# Altium schematic sheet [3] - PIC18F SUBSYSTEM SCHEMATIC.SchDoc (part 2 of 3)
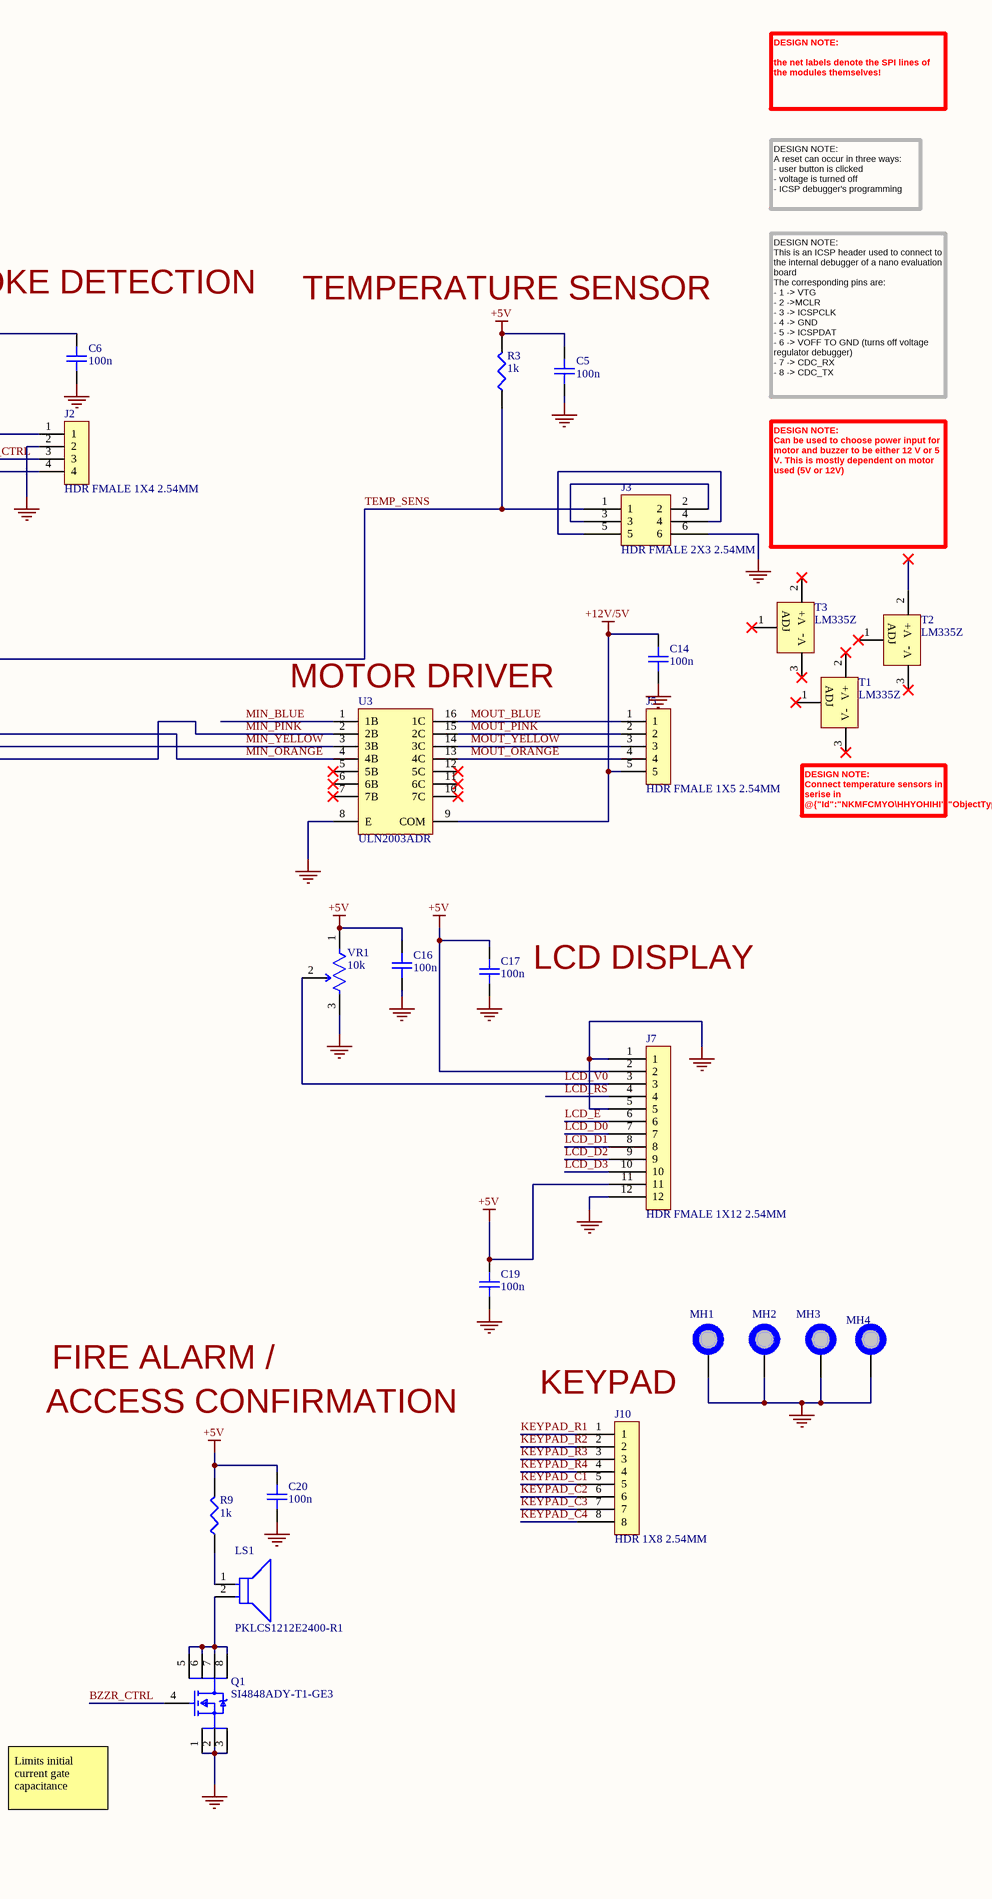
[diagram p2: [3] - PIC18F SUBSYSTEM SCHEMATIC.SchDoc, right]
## Library data of the parts
? = SDTitleBlock
C1 C2 C5-C7 C9 C10 C13-C24 = C2012X7R1H104K085AA: Ceramic Capacitor, Multilayer, Ceramic, 50V, 10% +Tol, 10% -Tol, X7R, 15% TC, 0.1uF, Surface Mount, 0805; Manufacturer: TDK; Value: 100nF; Multilayer: Yes; Supplier: Digikey; Supplier Part Number: 445-7534-1-ND; Manufacturer Part Number: C2012X7R1H104K085AA; RoHS: Yes; Category: Ceramic Capacitors; Stock: 1413569; Pricing: 1=0.13, 10=0.071, 50=0.0494, 100=0.0426, 500=0.03118, 1000=0.02762 (USD); Mounting Technology: Surface Mount; Pins: 2; Dielectric Material: Ceramic; Package Shape: Rectangular; Case/Package: 0805; Terminal Finish: Nickel; Min Operating Temperature: -55°C; Max Operating Temperature: 125°C; JESD-609 Code: e3; Capacitor Type: Ceramic; Tolerance  (fill in as +-): 10%; Package Style: SMTMeter; Packaging: Tape and Reel; Tolerance (fill in as +-): 10%; Rated DC Voltage (URdc): 50V; Temperature Characteristics Code: X7R; Termination: Wraparound; Length: 2mm; Width: 1.25mm; Height: 0.85mm; Reach SVHC Compliant: Yes; RoHS Compliant: Yes; ComponentLink1URL: https://datasheet.ciiva.com:443/pdfs/VipMasterIC/IC/TDKC/TDKC-S-A0008796792/TDKC-S-A0008796792-1.pdf?src-supplier=IHS+Markit; ComponentLink1Description: https://datasheet.ciiva.com:443/pdfs/VipMasterIC/IC/TDKC/TDKC-S-A0008796792/TDKC-S-A0008796792-1.pdf?src-supplier=IHS+Markit; ComponentLink2URL: https://datasheet.ciiva.com/11788/0900766b80c1bb00-11788128.pdf?src-supplier=Rs; ComponentLink2Description: https://datasheet.ciiva.com/11788/0900766b80c1bb00-11788128.pdf?src-supplier=Rs; ComponentLink3URL: https://datasheet.ciiva.com/23803/1796654-23803035.pdf?src-supplier=Newark; ComponentLink3Description: https://datasheet.ciiva.com/23803/1796654-23803035.pdf?src-supplier=Newark; ComponentLink4URL: https://datasheet.ciiva.com/28602/1571323-28602204.pdf?src-supplier=Element14; ComponentLink4Description: https://datasheet.ciiva.com/28602/1571323-28602204.pdf?src-supplier=Element14; ComponentLink5URL: https://datasheet.ciiva.com/6250/tdkmlcccaprange-6250824.pdf?src-supplier=Digikey; ComponentLink5Description: https://datasheet.ciiva.com/6250/tdkmlcccaprange-6250824.pdf?src-supplier=Digikey; ComponentLink6URL: https://datasheet.ciiva.com/24191/e412-c-24191447.pdf?src-supplier=Future+Electronics; ComponentLink6Description: https://datasheet.ciiva.com/24191/e412-c-24191447.pdf?src-supplier=Future+Electronics; ComponentLink7URL: https://datasheet.ciiva.com/6250/tdkmlcccaprange-6250821.pdf?src-supplier=Digikey; ComponentLink7Description: https://datasheet.ciiva.com/6250/tdkmlcccaprange-6250821.pdf?src-supplier=Digikey; Supplier 1: Digikey; Supplier Part Number 1: 445-7534-1-ND
C3 C4 C8 C11 C12 = C2012X5R1V106M125AC: Ceramic Capacitor, Multilayer, Ceramic, 35V, 20% +Tol, 20% -Tol, X5R, 15% TC, 10uF, Surface Mount, 0805; Manufacturer: TDK; Multilayer: Yes; Supplier: Digikey; Supplier Part Number: 445-14420-1-ND; Manufacturer Part Number: C2012X5R1V106M125AC; RoHS: Yes; Category: Ceramic Capacitors; Stock: 20704; Pricing: 1=0.71, 10=0.427, 50=0.3158, 100=0.2811, 500=0.22198, 1000=0.20353 (USD); Mounting Technology: Surface Mount; Pins: 2; Dielectric Material: Ceramic; Package Shape: Rectangular; Case/Package: 0805; Terminal Finish: Nickel; Min Operating Temperature: -55°C; Max Operating Temperature: 85°C; JESD-609 Code: e3; Value: 10uF; Capacitor Type: Ceramic; Tolerance  (fill in as +-): 20%; Package Style: SMTMeter; Packaging: Tape and Reel; Tolerance (fill in as +-): 20%; Rated DC Voltage (URdc): 35V; Temperature Characteristics Code: X5R; Termination: Wraparound; Length: 2mm; Width: 1.25mm; Height: 1.25mm; Reach SVHC Compliant: Yes; RoHS Compliant: Yes; ComponentLink1URL: https://datasheet.ciiva.com:443/pdfs/VipMasterIC/IC/TDKC/TDKC-S-A0008796792/TDKC-S-A0008796792-1.pdf?src-supplier=IHS+Markit; ComponentLink1Description: https://datasheet.ciiva.com:443/pdfs/VipMasterIC/IC/TDKC/TDKC-S-A0008796792/TDKC-S-A0008796792-1.pdf?src-supplier=IHS+Markit; ComponentLink2URL: https://datasheet.ciiva.com/14887/tdkmlcccaprange-14887484.pdf?src-supplier=Digikey; ComponentLink2Description: https://datasheet.ciiva.com/14887/tdkmlcccaprange-14887484.pdf?src-supplier=Digikey; ComponentLink3URL: https://datasheet.ciiva.com/14887/tdkmlcccaprange-14887483.pdf?src-supplier=Digikey; ComponentLink3Description: https://datasheet.ciiva.com/14887/tdkmlcccaprange-14887483.pdf?src-supplier=Digikey; ComponentLink4URL: https://datasheet.ciiva.com/14887/tdkmlcccaprange-14887485.pdf?src-supplier=Digikey; ComponentLink4Description: https://datasheet.ciiva.com/14887/tdkmlcccaprange-14887485.pdf?src-supplier=Digikey
  C3 C4: Supplier 1: Digikey; Supplier Part Number 1: 445-14420-1-ND
  C8 C11 C12: Supplier 1: Mouser; Supplier Part Number 1: 810-C2012X5R1V106M1C
D1 = VLHW5100: Single Color LED, White, Untinted Nondiffused, T-1 3/4, 5mm; Manufacturer: Vishay Semiconductors; Shape: Round; Lens Style: Untinted,NONDIFFUSED; Forward Current: 30mA; Forward Voltage: 3.6V; Luminous Intensity-Nom: 8400mcd; Channels: 1; Reverse Voltage-Max: 5V; T-code: T-1 3/4; Viewing Angle: 20°; Overall Height: 8.6mm; Supplier: Mouser; Supplier Part Number: 78-VLHW5100; Manufacturer Part Number: VLHW5100; RoHS: Yes; Category: LEDs; Stock: 22314; Pricing: 1=0.6, 10=0.363, 50=0.363, 100=0.21, 1000=0.153, 10000=0.127 (USD); Mounting Technology: Radial; Pins: 2; Color: White; Color@wavelength: White; Min Operating Temperature: -40°C; Max Operating Temperature: 100°C; Optoelectronic Device Type: SINGLE COLOR LED; Packaging: Bulk; Size: 5mm; Terminal Pitch: 2.54mm; RoHS Compliant: Yes; Reach SVHC Compliant: Yes; ComponentLink1URL: https://datasheet.ciiva.com:443/pdfs/VipMasterIC/IC/VISH/VISH-S-A0008255939/VISH-S-A0008255939-1.pdf?src-supplier=IHS+Markit; ComponentLink1Description: https://datasheet.ciiva.com:443/pdfs/VipMasterIC/IC/VISH/VISH-S-A0008255939/VISH-S-A0008255939-1.pdf?src-supplier=IHS+Markit; ComponentLink2URL: http://www.mouser.com/ds/2/427/vlhw5100-531364.pdf?src-supplier=Mouser; ComponentLink2Description: http://www.mouser.com/ds/2/427/vlhw5100-531364.pdf?src-supplier=Mouser; ComponentLink3URL: http://components.arrow.com/part/dataview/47619092S462016N5680?src-supplier=Arrow+Electronics; ComponentLink3Description: http://components.arrow.com/part/dataview/47619092S462016N5680?src-supplier=Arrow+Electronics; ComponentLink4URL: https://datasheet.octopart.com/VLHW5100-Vishay-datasheet-33014518.pdf?src-supplier=Newark; ComponentLink4Description: https://datasheet.octopart.com/VLHW5100-Vishay-datasheet-33014518.pdf?src-supplier=Newark; ComponentLink5URL: https://datasheet.octopart.com/VLHW5100-Vishay-datasheet-13709148.pdf?src-supplier=Future+Electronics; ComponentLink5Description: https://datasheet.octopart.com/VLHW5100-Vishay-datasheet-13709148.pdf?src-supplier=Future+Electronics; ComponentLink6URL: https://www.vishay.com/docs/81159/vlhw5100.pdf?src-supplier=Digikey; ComponentLink6Description: https://www.vishay.com/docs/81159/vlhw5100.pdf?src-supplier=Digikey; ComponentLink7URL: http://www.vishay.com/docs/81159/vlhw5100.pdf?src-supplier=Avnet; ComponentLink7Description: http://www.vishay.com/docs/81159/vlhw5100.pdf?src-supplier=Avnet; ComponentLink8URL: https://datasheet.octopart.com/VLHW5100-Vishay-datasheet-101602381.pdf?src-supplier=Farnell; ComponentLink8Description: https://datasheet.octopart.com/VLHW5100-Vishay-datasheet-101602381.pdf?src-supplier=Farnell; ComponentLink9URL: https://datasheet.octopart.com/VLHW5100-Vishay-datasheet-159770063.pdf?src-supplier=TME; ComponentLink9Description: https://datasheet.octopart.com/VLHW5100-Vishay-datasheet-159770063.pdf?src-supplier=TME; Supplier 1: Mouser; Supplier Part Number 1: 78-VLHW5100
D2 = SML-D12P8WT86: Single Color LED, Pure Green, Diffused Milky White, 1.2mm; Manufacturer: Rohm; Shape: Rectangular; Forward Current: 20mA; Luminous Intensity-Nom: 6.3mcd; Channels: 1; Reverse Voltage-Max: 5V; Overall Height: 0.55mm; Supplier: Digikey; Supplier Part Number: 846-SML-D12P8WT86CT-ND; Manufacturer Part Number: SML-D12P8WT86; RoHS: Yes; Category: LEDs; Stock: 50341; Pricing: 1=0.21, 10=0.115, 100=0.0686, 500=0.05056, 1000=0.04505 (USD); Mounting Technology: Surface Mount; Pins: 2; Color: Green; Color@wavelength: Green; Terminal Finish: Gold; Min Operating Temperature: -40°C; Max Operating Temperature: 85°C; JESD-609 Code: e4; Lens Style: Diffused; Optoelectronic Device Type: SINGLE COLOR LED; Packaging: Tape and Reel; Size: 1.2mm; Terminal Pitch: 1.65mm; Reach SVHC Compliant: Yes; RoHS Compliant: Yes; ComponentLink1URL: https://datasheet.ciiva.com:443/pdfs/VipMasterIC/IC/ROHM/ROHMS10041/ROHMS10041-1.pdf?src-supplier=IHS+Markit; ComponentLink1Description: https://datasheet.ciiva.com:443/pdfs/VipMasterIC/IC/ROHM/ROHMS10041/ROHMS10041-1.pdf?src-supplier=IHS+Markit; ComponentLink2URL: https://datasheet.ciiva.com/2110/sml-d1-2110417.pdf?src-supplier=Digikey; ComponentLink2Description: https://datasheet.ciiva.com/2110/sml-d1-2110417.pdf?src-supplier=Digikey; ComponentLink3URL: https://datasheet.ciiva.com/16488/rohm20sml-d12p8wt86-16488100.pdf?src-supplier=Future+Electronics; ComponentLink3Description: https://datasheet.ciiva.com/16488/rohm20sml-d12p8wt86-16488100.pdf?src-supplier=Future+Electronics; ComponentLink4URL: https://datasheet.ciiva.com/2110/sml-d1-2110419.pdf?src-supplier=Digikey; ComponentLink4Description: https://datasheet.ciiva.com/2110/sml-d1-2110419.pdf?src-supplier=Digikey; ComponentLink5URL: https://datasheet.ciiva.com/2110/sml-d1-2110418.pdf?src-supplier=Digikey; ComponentLink5Description: https://datasheet.ciiva.com/2110/sml-d1-2110418.pdf?src-supplier=Digikey; ComponentLink6URL: https://datasheet.ciiva.com/3161/sml-d1-3161420.pdf?src-supplier=Avnet; ComponentLink6Description: https://datasheet.ciiva.com/3161/sml-d1-3161420.pdf?src-supplier=Avnet; Supplier 1: Digikey; Supplier Part Number 1: 846-SML-D12P8WT86CT-ND
D3 D4 D? = BAT54HT1G: Rectifier Diode, 1 Phase, 1 Element, 0.2A, 30V V(RRM), Silicon; Manufacturer: ON Semiconductor / Fairchild; Package Body Material: Plastic; Number of Elements: 1; Max Output current: 200mA; Max Power Dissipation: 200mW; Reverse Recovery Time-Max: 0.005us; Forward Voltage: 240mV; Non-rep Pk Forward Current-Max: 600mA; Qualification Status: Not Qualified; Supplier: Digikey; Supplier Part Number: BAT54HT1GOSCT-ND; Manufacturer Part Number: BAT54HT1G; RoHS: Yes; Category: Schottky Diodes; Stock: 217359; Pricing: 1=0.12, 10=0.085, 100=0.0569, 500=0.04318, 1000=0.03851 (USD); Pins: 2; Diode Element Material: SILICON; Package Shape: Rectangular; Terminal Finish: Tin; Min Operating Temperature: -55°C; Max Operating Temperature: 150°C; Diode Type: RECTIFIER; JESD-30 Code: R-PDSO-G2; Package Style: SMALL OUTLINEMeter; Rep Pk Reverse Voltage-Max: 30V; Surface Mount: Yes; Terminal Form: Gull Wing; Terminal Position: DUAL; JESD-609 Code: e3; Moisture Sensitivity Level: 1; RoHS Compliant: Yes; Reach SVHC Compliant: Yes; ComponentLink1URL: https://datasheet.ciiva.com:443/pdfs/VipMasterIC/IC/FAIR/FAIRS45107/FAIRS45107-1.pdf?src-supplier=IHS+Markit; ComponentLink1Description: https://datasheet.ciiva.com:443/pdfs/VipMasterIC/IC/FAIR/FAIRS45107/FAIRS45107-1.pdf?src-supplier=IHS+Markit; ComponentLink2URL: https://datasheet.ciiva.com/4714/bat54ht1-d-72881-4714706.pdf?src-supplier=Mouser; ComponentLink2Description: https://datasheet.ciiva.com/4714/bat54ht1-d-72881-4714706.pdf?src-supplier=Mouser; ComponentLink3URL: https://datasheet.ciiva.com/4452/bat54ht1g-104602-4452889.pdf?src-supplier=Mouser; ComponentLink3Description: https://datasheet.ciiva.com/4452/bat54ht1g-104602-4452889.pdf?src-supplier=Mouser; ComponentLink4URL: https://datasheet.ciiva.com/30479/0900766b811a63a9-30479442.pdf?src-supplier=Rs; ComponentLink4Description: https://datasheet.ciiva.com/30479/0900766b811a63a9-30479442.pdf?src-supplier=Rs; ComponentLink5URL: https://datasheet.ciiva.com/34301/806549-34301562.pdf?src-supplier=Jameco; ComponentLink5Description: https://datasheet.ciiva.com/34301/806549-34301562.pdf?src-supplier=Jameco; ComponentLink6URL: https://datasheet.ciiva.com/1240/1747983-1240762.pdf?src-supplier=Newark; ComponentLink6Description: https://datasheet.ciiva.com/1240/1747983-1240762.pdf?src-supplier=Newark; ComponentLink7URL: https://datasheet.ciiva.com/915/bat54ht1-d-915445.pdf?src-supplier=Digikey; ComponentLink7Description: https://datasheet.ciiva.com/915/bat54ht1-d-915445.pdf?src-supplier=Digikey; ComponentLink8URL: https://datasheet.ciiva.com/915/bat54ht1-d-915444.pdf?src-supplier=Digikey; ComponentLink8Description: https://datasheet.ciiva.com/915/bat54ht1-d-915444.pdf?src-supplier=Digikey; ComponentLink9URL: https://datasheet.ciiva.com/910/bat54ht1g-910499.pdf?src-supplier=Digikey; ComponentLink9Description: https://datasheet.ciiva.com/910/bat54ht1g-910499.pdf?src-supplier=Digikey; ComponentLink10URL: https://datasheet.ciiva.com/910/bat54ht1g-910498.pdf?src-supplier=Digikey; ComponentLink10Description: https://datasheet.ciiva.com/910/bat54ht1g-910498.pdf?src-supplier=Digikey; ComponentLink11URL: https://datasheet.ciiva.com/8294/bat54ht1-d-8294645.pdf?src-supplier=Avnet; ComponentLink11Description: https://datasheet.ciiva.com/8294/bat54ht1-d-8294645.pdf?src-supplier=Avnet; ComponentLink12URL: https://datasheet.ciiva.com/910/bat54ht1g-910497.pdf?src-supplier=Digikey; ComponentLink12Description: https://datasheet.ciiva.com/910/bat54ht1g-910497.pdf?src-supplier=Digikey; ComponentLink13URL: https://datasheet.ciiva.com/8303/bat54ht1g-8303645.pdf?src-supplier=Avnet; ComponentLink13Description: https://datasheet.ciiva.com/8303/bat54ht1g-8303645.pdf?src-supplier=Avnet; ComponentLink14URL: https://datasheet.ciiva.com/915/bat54ht1-d-915443.pdf?src-supplier=Digikey; ComponentLink14Description: https://datasheet.ciiva.com/915/bat54ht1-d-915443.pdf?src-supplier=Digikey; ComponentLink15URL: https://datasheet.ciiva.com/46429/1727620-46429206.pdf?src-supplier=Element14; ComponentLink15Description: https://datasheet.ciiva.com/46429/1727620-46429206.pdf?src-supplier=Element14; ComponentLink16URL: https://datasheet.ciiva.com/1180/bat54ht1-d-1180252.pdf?src-supplier=Element14; ComponentLink16Description: https://datasheet.ciiva.com/1180/bat54ht1-d-1180252.pdf?src-supplier=Element14; ComponentLink17URL: https://datasheet.ciiva.com/1180/bat54ht1-d-1180251.pdf?src-supplier=Element14; ComponentLink17Description: https://datasheet.ciiva.com/1180/bat54ht1-d-1180251.pdf?src-supplier=Element14; ComponentLink18URL: https://datasheet.ciiva.com/17020/bat54ht1g-17020445.pdf?src-supplier=Future+Electronics; ComponentLink18Description: https://datasheet.ciiva.com/17020/bat54ht1g-17020445.pdf?src-supplier=Future+Electronics; ComponentLink19URL: https://datasheet.ciiva.com/48686/001262925-da-01-en-diode-schottky-30v-bat54ht1g-sod-323-fsc-48686266.pdf?src-supplier=Conrad; ComponentLink19Description: https://datasheet.ciiva.com/48686/001262925-da-01-en-diode-schottky-30v-bat54ht1g-sod-323-fsc-48686266.pdf?src-supplier=Conrad
  D3 D4: Supplier 1: Digikey; Supplier Part Number 1: BAT54HT1GOSCT-ND
  D?: Supplier 1: Mouser; Supplier Part Number 1: 863-BAT54HT1G
FB1 FB2 = MPZ2012S601AT000: Ferrite Chip, 1 Function(s), 2A; Manufacturer: TDK; DC Resistance-Max: 100mR; Clock Frequency: 100MHz; Channels: 1; Output Impedance: 600R; Supplier: Digikey; Supplier Part Number: 445-MPZ2012S601AT000CT-ND; Manufacturer Part Number: MPZ2012S601AT000; RoHS: Yes; Category: Ferrite Beads and Chips; Stock: 125666; Pricing: 1=0.11, 10=0.077, 25=0.0664, 50=0.0594, 100=0.0532, 250=0.0458, 500=0.0407, 1000=0.03605 (USD); Mounting Technology: Surface Mount; Material: Ferrite; Case Code: 0805; Terminal Finish: Copper; Min Operating Temperature: -55°C; Max Operating Temperature: 125°C; JESD-609 Code: e2; Construction: Chip Bead; Filter Type: FERRITE CHIP; Min Frequency: 100MHz; Packaging: Tape and Reel; Current Rating: 2A; Length: 2mm; Width: 1.25mm; Height: 0.85mm; Reach SVHC Compliant: Yes; RoHS Compliant: Yes; ComponentLink1URL: https://datasheet.ciiva.com:443/pdfs/VipMasterIC/IC/TDKC/TDKC-S-A0008032886/TDKC-S-A0008032886-1.pdf?src-supplier=IHS+Markit; ComponentLink1Description: https://datasheet.ciiva.com:443/pdfs/VipMasterIC/IC/TDKC/TDKC-S-A0008032886/TDKC-S-A0008032886-1.pdf?src-supplier=IHS+Markit; ComponentLink2URL: https://datasheet.ciiva.com/46634/beads-commercial-power-mpz-en-46634335.pdf?src-supplier=Digikey; ComponentLink2Description: https://datasheet.ciiva.com/46634/beads-commercial-power-mpz-en-46634335.pdf?src-supplier=Digikey; ComponentLink3URL: https://datasheet.ciiva.com/46634/beads-commercial-power-mpz-en-46634377.pdf?src-supplier=Digikey; ComponentLink3Description: https://datasheet.ciiva.com/46634/beads-commercial-power-mpz-en-46634377.pdf?src-supplier=Digikey; ComponentLink4URL: https://datasheet.ciiva.com/46634/beads-commercial-power-mpz-en-46634606.pdf?src-supplier=Digikey; ComponentLink4Description: https://datasheet.ciiva.com/46634/beads-commercial-power-mpz-en-46634606.pdf?src-supplier=Digikey; Supplier 1: Mouser; Supplier Part Number 1: 810-MPZ2012S601AT000
J1 J2 = M20-7820442: Board Connector, 4 Contact(s), 1 Row(s), Female, Straight, 0.1 inch Pitch, Solder Terminal, Locking, Black Insulator, Socket; Manufacturer: Harwin; Option: General Purpose; Contact Pattern: RECTANGULAR; Contact Resistance: 20mR; Contact Style: SQ PIN-SKT; Dielectric Withstanding Voltage (AC): 1kV; Durability: 300Cycles; Filter Feature: No; Insulation Resistance: 1GR; Number Of Connectors: 1; Polarization Key: POLARIZED HOUSING; Rated Current (Signal): 3A; Number of Contacts: 4; Body Breadth: 0.098inch; Body Depth: 0.335inch; Body Length: 0.4inch; Reference Standard: UL; Reliability: COMMERCIAL; Supplier: Mouser; Supplier Part Number: 855-M20-7820442; Manufacturer Part Number: M20-7820442; RoHS: Yes; Category: Headers and Wire Housings; Stock: 2160; Pricing: 1=1.19, 10=0.794, 50=0.794, 100=0.794, 1000=0.616, 10000=0.491 (USD); Mounting Technology: Board; Contact Finish - Mating: GOLD; Contact Finish - Termination: Tin (Sn) - with Nickel (Ni) barrier; Insulation Color: Black; Insulation Material: Polyamide; Min Operating Temperature: -40°C; Max Operating Temperature: 105°C; Connector Type: BOARD CONNECTOR; JESD-609 Code: e3; Body/Shell Style: SOCKET; Contact Gender: Female; Mixed Contacts: No; Mounting Style: STRAIGHT; Number Of PCB Rows: 1; Number of Rows Loaded: 1; PCB Contact Pattern: RECTANGULAR; Termination: Solder; Mating Contact Pitch: 0.1inch; Mounting Option 1: LOCKING; Terminal Length: 0.118inch; Terminal Pitch: 2.54mm; Flammability Rating: UL94 V-0; DIN Conformance: No; IEC Conformance: No; MIL Conformance: No; Reach SVHC Compliant: Yes; RoHS Compliant: Yes; ComponentLink1URL: https://datasheet.ciiva.com:443/pdfs/VipMasterIC/IC/HRWN/HRWN-S-A0004894635/HRWN-S-A0004894635-1.pdf?src-supplier=IHS+Markit; ComponentLink1Description: https://datasheet.ciiva.com:443/pdfs/VipMasterIC/IC/HRWN/HRWN-S-A0004894635/HRWN-S-A0004894635-1.pdf?src-supplier=IHS+Markit; ComponentLink2URL: http://www.mouser.com/ds/2/181/Harwin_Product_Catalog_page_197-1134272.pdf?src-supplier=Mouser; ComponentLink2Description: http://www.mouser.com/ds/2/181/Harwin_Product_Catalog_page_197-1134272.pdf?src-supplier=Mouser; ComponentLink3URL: http://www.harwin.com/include/downloads/pdfs/2010PAGE120.PDF?src-supplier=Avnet; ComponentLink3Description: http://www.harwin.com/include/downloads/pdfs/2010PAGE120.PDF?src-supplier=Avnet; ComponentLink4URL: https://cdn.harwin.com/pdfs/Harwin_PC_Connectors_M20.pdf?src-supplier=Digikey; ComponentLink4Description: https://cdn.harwin.com/pdfs/Harwin_PC_Connectors_M20.pdf?src-supplier=Digikey; Supplier 1: Mouser; Supplier Part Number 1: 855-M20-7820442
J3 = M20-7830342: Board Connector, 6 Contact(s), 2 Row(s), Female, Straight, 0.1 inch Pitch, Solder Terminal, Locking, Black Insulator, Socket; Manufacturer: Harwin; Option: General Purpose; Contact Pattern: RECTANGULAR; Contact Resistance: 20mR; Contact Style: SQ PIN-SKT; Filter Feature: No; Insulation Resistance: 1GR; Number Of Connectors: 1; Number Of PCB Rows: 2; PCB Contact Pattern: STAGGERED; Polarization Key: POLARIZED HOUSING; Rated Current (Signal): 3A; Number of Contacts: 6; Body Breadth: 0.198inch; Body Depth: 0.335inch; Body Length: 0.316inch; Reference Standard: UL; Reliability: COMMERCIAL; Supplier: Mouser; Supplier Part Number: 855-M20-7830342; Manufacturer Part Number: M20-7830342; RoHS: Yes; Category: Headers and Wire Housings; Pricing: 1=1.64, 10=1.63, 50=1.63, 100=1, 1000=0.874, 10000=0.697 (USD); Mounting Technology: Board; Contact Material: Bronze; Contact Finish - Mating: GOLD; Contact Finish - Termination: TIN; Insulation Color: Black; Insulation Material: Polyamide; Min Operating Temperature: -40°C; Max Operating Temperature: 105°C; Connector Type: BOARD CONNECTOR; JESD-609 Code: e3; Body/Shell Style: SOCKET; Contact Gender: Female; Mixed Contacts: No; Mounting Style: STRAIGHT; Number of Rows Loaded: 2; Termination: Solder; Mating Contact Pitch: 0.1inch; Mating Contact Row Spacing: 0.1inch; Mounting Option 1: LOCKING; PCB Contact Row Spacing: 2.54mm; Terminal Length: 0.118inch; Terminal Pitch: 2.54mm; Flammability Rating: UL94 V-0; Reach SVHC Compliant: Yes; RoHS Compliant: Yes; DIN Conformance: No; IEC Conformance: No; MIL Conformance: No; ComponentLink1URL: https://datasheet.ciiva.com:443/pdfs/VipMasterIC/IC/HRWN/HRWN-S-A0004894635/HRWN-S-A0004894635-1.pdf?src-supplier=IHS+Markit; ComponentLink1Description: https://datasheet.ciiva.com:443/pdfs/VipMasterIC/IC/HRWN/HRWN-S-A0004894635/HRWN-S-A0004894635-1.pdf?src-supplier=IHS+Markit; ComponentLink2URL: https://datasheet.ciiva.com/6800/m20-783-6800556.pdf?src-supplier=Digikey; ComponentLink2Description: https://datasheet.ciiva.com/6800/m20-783-6800556.pdf?src-supplier=Digikey; Supplier 1: Mouser; Supplier Part Number 1: 855-M20-7830342
J4 J6 = 10129381-908001BLF: Conn Unshrouded Header HDR 8 POS 2.54mm Solder ST Thru-Hole Poly Bag; Manufacturer: Amphenol ICC / FCI; Supplier: Mouser; Supplier Part Number: 649-1012938190801BLF; Manufacturer Part Number: 10129381-908001BLF; RoHS: No; Category: Connectors; Stock: 4941; Pricing: 1=0.23, 10=0.172, 50=0.172, 100=0.131, 1000=0.101, 10000=0.076 (USD); Supplier 1: Mouser; Supplier Part Number 1: 649-1012938190801BLF
J5 = M20-7820542: Board Connector, 5 Contact(s), 1 Row(s), Female, Straight, 0.1 inch Pitch, Solder Terminal, Locking, Black Insulator, Socket; Manufacturer: Harwin; Option: General Purpose; Contact Pattern: RECTANGULAR; Contact Resistance: 20mR; Contact Style: SQ PIN-SKT; Dielectric Withstanding Voltage (AC): 1kV; Durability: 300Cycles; Filter Feature: No; Insulation Resistance: 1GR; Number Of Connectors: 1; Polarization Key: POLARIZED HOUSING; Rated Current (Signal): 3A; Number of Contacts: 5; Body Breadth: 0.098inch; Body Depth: 0.335inch; Body Length: 0.5inch; Reference Standard: UL; Reliability: COMMERCIAL; Supplier: Mouser; Supplier Part Number: 855-M20-7820542; Manufacturer Part Number: M20-7820542; RoHS: Yes; Category: Headers and Wire Housings; Stock: 1002; Pricing: 1=1.07, 10=0.701, 50=0.701, 100=0.612, 1000=0.54, 10000=0.496 (USD); Mounting Technology: Board; Contact Finish - Mating: GOLD; Contact Finish - Termination: Tin (Sn) - with Nickel (Ni) barrier; Insulation Color: Black; Insulation Material: Polyamide; Min Operating Temperature: -40°C; Max Operating Temperature: 105°C; Connector Type: BOARD CONNECTOR; JESD-609 Code: e3; Body/Shell Style: SOCKET; Contact Gender: Female; Mixed Contacts: No; Mounting Style: STRAIGHT; Number Of PCB Rows: 1; Number of Rows Loaded: 1; PCB Contact Pattern: RECTANGULAR; Termination: Solder; Mating Contact Pitch: 0.1inch; Mounting Option 1: LOCKING; Terminal Length: 0.118inch; Terminal Pitch: 2.54mm; Flammability Rating: UL94 V-0; Reach SVHC Compliant: Yes; RoHS Compliant: Yes; DIN Conformance: No; IEC Conformance: No; MIL Conformance: No; ComponentLink1URL: https://datasheet.ciiva.com:443/pdfs/VipMasterIC/IC/HRWN/HRWN-S-A0004894635/HRWN-S-A0004894635-1.pdf?src-supplier=IHS+Markit; ComponentLink1Description: https://datasheet.ciiva.com:443/pdfs/VipMasterIC/IC/HRWN/HRWN-S-A0004894635/HRWN-S-A0004894635-1.pdf?src-supplier=IHS+Markit; ComponentLink2URL: https://datasheet.ciiva.com/6785/m20-782-6785372.pdf?src-supplier=Digikey; ComponentLink2Description: https://datasheet.ciiva.com/6785/m20-782-6785372.pdf?src-supplier=Digikey
J7 = M20-7821242: Board Connector, 12 Contact(s), 1 Row(s), Female, Straight, 0.1 inch Pitch, Solder Terminal, Locking, Black Insulator, Socket; Manufacturer: Harwin; Option: General Purpose; Contact Pattern: RECTANGULAR; Contact Resistance: 20mR; Contact Style: SQ PIN-SKT; Dielectric Withstanding Voltage (AC): 1kV; Durability: 300Cycles; Filter Feature: No; Insulation Resistance: 1GR; Number Of Connectors: 1; Polarization Key: POLARIZED HOUSING; Rated Current (Signal): 3A; Number of Contacts: 12; Body Breadth: 0.098inch; Body Depth: 0.335inch; Body Length: 1.2inch; Reference Standard: UL; Reliability: COMMERCIAL; Supplier: Mouser; Supplier Part Number: 855-M20-7821242; Manufacturer Part Number: M20-7821242; RoHS: Yes; Category: Headers and Wire Housings; Stock: 1101; Pricing: 1=1.87, 10=1.36, 50=1.36, 100=1.36, 1000=1.03, 10000=0.9 (USD); Mounting Technology: Board; Contact Finish - Mating: GOLD; Contact Finish - Termination: TIN; Insulation Color: Black; Insulation Material: Polyamide; Min Operating Temperature: -40°C; Max Operating Temperature: 105°C; Connector Type: BOARD CONNECTOR; JESD-609 Code: e3; Body/Shell Style: SOCKET; Contact Gender: Female; Mixed Contacts: No; Mounting Style: STRAIGHT; Number Of PCB Rows: 1; Number of Rows Loaded: 1; PCB Contact Pattern: RECTANGULAR; Termination: Solder; Mating Contact Pitch: 0.1inch; Mounting Option 1: LOCKING; Terminal Length: 0.118inch; Terminal Pitch: 2.54mm; Flammability Rating: UL94 V-0; DIN Conformance: No; IEC Conformance: No; MIL Conformance: No; Reach SVHC Compliant: Yes; RoHS Compliant: Yes; ComponentLink1URL: https://datasheet.ciiva.com:443/pdfs/VipMasterIC/IC/HRWN/HRWN-S-A0004894635/HRWN-S-A0004894635-1.pdf?src-supplier=IHS+Markit; ComponentLink1Description: https://datasheet.ciiva.com:443/pdfs/VipMasterIC/IC/HRWN/HRWN-S-A0004894635/HRWN-S-A0004894635-1.pdf?src-supplier=IHS+Markit; ComponentLink2URL: http://www.mouser.com/ds/2/181/Harwin_Product_Catalog_page_197-1134272.pdf?src-supplier=Mouser; ComponentLink2Description: http://www.mouser.com/ds/2/181/Harwin_Product_Catalog_page_197-1134272.pdf?src-supplier=Mouser; ComponentLink3URL: http://www.harwin.com/include/downloads/drawings/M20-782.PDF?src-supplier=Avnet; ComponentLink3Description: http://www.harwin.com/include/downloads/drawings/M20-782.PDF?src-supplier=Avnet; ComponentLink4URL: https://cdn.harwin.com/pdfs/Harwin_Product_Catalog_page_197.pdf?src-supplier=Digikey; ComponentLink4Description: https://cdn.harwin.com/pdfs/Harwin_Product_Catalog_page_197.pdf?src-supplier=Digikey; Supplier 1: Mouser; Supplier Part Number 1: 855-M20-7821242
J8 = M20-7820842: Board Connector, 8 Contact(s), 1 Row(s), Female, Straight, 0.1 inch Pitch, Solder Terminal, Locking, Black Insulator, Socket; Manufacturer: Harwin; Option: General Purpose; Contact Pattern: RECTANGULAR; Contact Resistance: 20mR; Contact Style: SQ PIN-SKT; Dielectric Withstanding Voltage (AC): 1kV; Durability: 300Cycles; Filter Feature: No; Insulation Resistance: 1GR; Number Of Connectors: 1; Polarization Key: POLARIZED HOUSING; Rated Current (Signal): 3A; Number of Contacts: 8; Body Breadth: 0.098inch; Body Depth: 0.335inch; Body Length: 0.8inch; Reference Standard: UL; Reliability: COMMERCIAL; Supplier: Mouser; Supplier Part Number: 855-M20-7820842; Manufacturer Part Number: M20-7820842; RoHS: Yes; Category: Headers and Wire Housings; Stock: 1924; Pricing: 1=1.55, 10=1.07, 50=1.07, 100=1.07, 1000=0.823, 10000=0.655 (USD); Mounting Technology: Board; Contact Finish - Mating: GOLD; Contact Finish - Termination: Tin (Sn) - with Nickel (Ni) barrier; Insulation Color: Black; Insulation Material: Polyamide; Min Operating Temperature: -40°C; Max Operating Temperature: 105°C; Connector Type: BOARD CONNECTOR; JESD-609 Code: e3; Body/Shell Style: SOCKET; Contact Gender: Female; Mixed Contacts: No; Mounting Style: STRAIGHT; Number Of PCB Rows: 1; Number of Rows Loaded: 1; PCB Contact Pattern: RECTANGULAR; Termination: Solder; Mating Contact Pitch: 0.1inch; Mounting Option 1: LOCKING; Terminal Length: 0.118inch; Terminal Pitch: 2.54mm; Flammability Rating: UL94 V-0; DIN Conformance: No; IEC Conformance: No; MIL Conformance: No; Reach SVHC Compliant: Yes; RoHS Compliant: Yes; ComponentLink1URL: https://datasheet.ciiva.com:443/pdfs/VipMasterIC/IC/HRWN/HRWN-S-A0004894635/HRWN-S-A0004894635-1.pdf?src-supplier=IHS+Markit; ComponentLink1Description: https://datasheet.ciiva.com:443/pdfs/VipMasterIC/IC/HRWN/HRWN-S-A0004894635/HRWN-S-A0004894635-1.pdf?src-supplier=IHS+Markit; ComponentLink2URL: https://datasheet.ciiva.com/9480/m20-782-9480074.pdf?src-supplier=Avnet; ComponentLink2Description: https://datasheet.ciiva.com/9480/m20-782-9480074.pdf?src-supplier=Avnet; Supplier 1: Mouser; Supplier Part Number 1: 855-M20-7820842
J9 JP1 = 68705-103HLF: Conn Unshrouded Header HDR 3 POS 2.54mm Solder ST Thru-Hole Bag; Manufacturer: Amphenol ICC / FCI; Manufacturer Series: 68705; Connector Type: BOARD CONNECTOR; Option: General Purpose; Filter Feature: No; Number of Rows Loaded: 1; Number of Contacts: 3; Manufacturer Part Number: 68705-103HLF; RoHS: Yes; Category: Connectors; Mounting Technology: Board; Contact Material: Bronze; Contact Finish - Mating: GOLD (30) OVER NICKEL (50)/GOLD FLASH OVER PALLADIUM NICKEL (30); Contact Finish - Termination: GOLD (30) OVER NICKEL (50)/GOLD FLASH OVER PALLADIUM NICKEL (30); JESD-609 Code: e4; Contact Gender: Male; Mixed Contacts: No; Mounting Style: STRAIGHT; Termination: Solder; Terminal Pitch: 2.54mm; Flammability Rating: UL94 V-0; DIN Conformance: No; IEC Conformance: No; MIL Conformance: No; Reach SVHC Compliant: Yes; RoHS Compliant: Yes; ComponentLink1URL: https://datasheet.ciiva.com/10144/68000-10144809.pdf?src-supplier=Avnet; ComponentLink1Description: https://datasheet.ciiva.com/10144/68000-10144809.pdf?src-supplier=Avnet; ComponentLink2URL: https://datasheet.ciiva.com/721/68000-721945.pdf?src-supplier=Digikey; ComponentLink2Description: https://datasheet.ciiva.com/721/68000-721945.pdf?src-supplier=Digikey
  J9: Supplier: Mouser; Supplier Part Number: 649-68705-103HLF; Stock: 575; Pricing: 1=0.41, 10=0.311, 50=0.311, 100=0.247, 1000=0.193, 10000=0.158 (USD); Supplier 1: Mouser; Supplier Part Number 1: 649-68705-103HLF
  JP1: Supplier: Digikey; Supplier Part Number: 609-68705-103HLF-ND; Stock: 5876; Pricing: 1=0.41, 10=0.311, 100=0.2462, 500=0.21082, 1000=0.19297, 5000=0.1619, 10000=0.15811 (USD); Supplier 1: Digikey; Supplier Part Number 1: 609-68705-103HLF-ND
J10 = 77311-101-08LF: Conn Unshrouded Header HDR 8 POS 2.54mm Solder ST Top Entry Thru-Hole Bulk; Manufacturer: Amphenol ICC / FCI; Supplier: Mouser; Supplier Part Number: 649-77311-101-08LF; Manufacturer Part Number: 77311-101-08LF; RoHS: Yes; Category: Connectors; Stock: 1079; Pricing: 1=0.57, 10=0.438, 50=0.438, 100=0.348, 1000=0.317, 10000=0.245 (USD); ComponentLink1URL: https://datasheet.ciiva.com/11746/0900766b80d78e8c-11746965.pdf?src-supplier=Rs; ComponentLink1Description: https://datasheet.ciiva.com/11746/0900766b80d78e8c-11746965.pdf?src-supplier=Rs; ComponentLink2URL: https://datasheet.ciiva.com/5154/77311-5154589.pdf?src-supplier=Mouser; ComponentLink2Description: https://datasheet.ciiva.com/5154/77311-5154589.pdf?src-supplier=Mouser; ComponentLink3URL: https://datasheet.ciiva.com/722/77311-722434.pdf?src-supplier=Digikey; ComponentLink3Description: https://datasheet.ciiva.com/722/77311-722434.pdf?src-supplier=Digikey; Supplier 1: Mouser; Supplier Part Number 1: 649-77311-101-08LF
LINK1 = QPC02SXGN-RC: Shunts/Jumper Connector; Manufacturer: Sullins; Manufacturer Series: QPC; Contact Pattern: RECTANGULAR; Contact Style: SQ PIN-SKT; Number Of Connectors: 1; Polarization Key: POLARIZED HOUSING; Rated Current (Signal): 3A; Body Breadth: 0.097inch; Body Depth: 0.235inch; Body Length: 0.197inch; Mating Contact Pitch: 0.1inch; Mounting Option 1: LOCKING; Reference Standard: UL; Reliability: COMMERCIAL; Supplier: Digikey; Supplier Part Number: S9337-ND; Manufacturer Part Number: QPC02SXGN-RC; RoHS: Yes; Category: Connectors; Stock: 587197; Pricing: 1=0.1, 10=0.048, 25=0.0428, 50=0.0396, 100=0.0365, 250=0.0328, 500=0.03026, 2000=0.02586, 4000=0.02395 (USD); Contact Material: Brass; Contact Finish - Mating: AU; Insulation Material: Polybutylene; Connector Type: SHUNTS / JUMPER CONNECTOR; Contact Gender: Female; Mounting Style: STRAIGHT; Number of Rows Loaded: 1; Number of Contacts: 1; Reach SVHC Compliant: Yes; RoHS Compliant: Yes; ComponentLink1URL: https://datasheet.ciiva.com:443/pdfs/VipMasterIC/IC/SUCS/SUCS-S-Z0000000006/SUCS-S-Z0000000006-1.pdf?src-supplier=IHS+Markit; ComponentLink1Description: https://datasheet.ciiva.com:443/pdfs/VipMasterIC/IC/SUCS/SUCS-S-Z0000000006/SUCS-S-Z0000000006-1.pdf?src-supplier=IHS+Markit; ComponentLink2URL: https://datasheet.ciiva.com/767/284-sxgn-11510-767869.pdf?src-supplier=Digikey; ComponentLink2Description: https://datasheet.ciiva.com/767/284-sxgn-11510-767869.pdf?src-supplier=Digikey; Supplier 1: Digikey; Supplier Part Number 1: S9337-ND
LS1 = PKLCS1212E2400-R1: Piezo Electric devices; Manufacturer: Murata; Supplier: Mouser; Supplier Part Number: 81-PKLCS1212E2400-R1; Manufacturer Part Number: PKLCS1212E2400-R1; RoHS: Yes; Category: Speakers; Stock: 10538; Pricing: 1=2.36, 10=1.62, 50=1.39, 100=1.13, 1000=0.76, 10000=0.738 (USD); ComponentLink1URL: https://datasheet.ciiva.com:443/pdfs/VipMasterIC/IC/MURE/MURE-S-A0001469919/MURE-S-A0001469919-1.pdf?src-supplier=IHS+Markit; ComponentLink1Description: https://datasheet.ciiva.com:443/pdfs/VipMasterIC/IC/MURE/MURE-S-A0001469919/MURE-S-A0001469919-1.pdf?src-supplier=IHS+Markit; ComponentLink2URL: https://datasheet.ciiva.com/46412/1851881-46412335.pdf?src-supplier=Element14; ComponentLink2Description: https://datasheet.ciiva.com/46412/1851881-46412335.pdf?src-supplier=Element14; Supplier 1: Mouser; Supplier Part Number 1: 81-PKLCS1212E2400-R1
MH1-MH4 = MH_7.4MMC_3.2: Mounting Hole 7.4mm Diameter, 3.2mm Drill
Q1 = SI4848ADY-T1-GE3: Small Signal Field-Effect Transistor; Manufacturer: Vishay; Supplier: Mouser; Supplier Part Number: 78-SI4848ADY-T1-GE3; Manufacturer Part Number: SI4848ADY-T1-GE3; RoHS: Yes; Category: MOSFETs; Stock: 19572; Pricing: 1=0.68, 10=0.622, 50=0.622, 100=0.415, 1000=0.292, 10000=0.225 (USD); ComponentLink1URL: https://datasheet.ciiva.com:443/pdfs/VipMasterIC/IC/VISH/VISH-S-A0003079622/VISH-S-A0003079622-1.pdf?src-supplier=IHS+Markit; ComponentLink1Description: https://datasheet.ciiva.com:443/pdfs/VipMasterIC/IC/VISH/VISH-S-A0003079622/VISH-S-A0003079622-1.pdf?src-supplier=IHS+Markit; ComponentLink2URL: http://www.farnell.com/datasheets/2687467.pdf?src-supplier=Farnell; ComponentLink2Description: http://www.farnell.com/datasheets/2687467.pdf?src-supplier=Farnell; ComponentLink3URL: http://www.farnell.com/datasheets/2687467.pdf?src-supplier=Newark; ComponentLink3Description: http://www.farnell.com/datasheets/2687467.pdf?src-supplier=Newark; ComponentLink4URL: https://www.vishay.com/docs/77716/si4848ady.pdf?src-supplier=Digikey; ComponentLink4Description: https://www.vishay.com/docs/77716/si4848ady.pdf?src-supplier=Digikey; Supplier 1: Mouser; Supplier Part Number 1: 78-SI4848ADY-T1-GE3
R1 R2 = RC0805JR-070RL: GENERAL PURPOSE CHIP RESISTOR Metal Glaze/thick Film, 0.125W, 0ohm, Surface Mount, 0805; Manufacturer: Yageo; Value: 0mR; Tolerance: 5%; Voltage Rating: 150V; Power Rating: 125mW; Temperature Coefficient: 200ppm/°C; Supplier: Digikey; Supplier Part Number: 311-0.0ARCT-ND; Manufacturer Part Number: RC0805JR-070RL; RoHS: Yes; Category: Chip SMD Resistors; Stock: 1340416; Pricing: 1=0.1, 10=0.016, 25=0.0116, 50=0.0072, 100=0.0066, 250=0.00612 (USD); Case/Package: 0805; Pins: 2; Contact Plating: Tin,Matte; Case Code (Imperial): 0805; Case Code (Metric): 2012; Min Operating Temperature: -55°C; Max Operating Temperature: 155°C; Resistor Type: Thick Film; Packaging: Tape and Reel; Voltage Rating (DC): 150V; Termination: SMD/SMT; Features: Moisture Resistant; Series: RC; Max Power Dissipation: 125mW; Number of Terminations: 2; Construction: Rectangular; Technology: THICK FILM; Resistance Tolerance: 5%; Length: 2mm; Width: 1.25mm; Height: 0.5mm; Depth: 1.25mm; RoHS Compliant: Yes; Military Standard: Not; Reach SVHC Compliant: Unknown; Lead Free: 5697LeadFree; ComponentLink1URL: https://datasheet.ciiva.com/11819/0900766b8106beab-11819430.pdf?src-supplier=Rs; ComponentLink1Description: https://datasheet.ciiva.com/11819/0900766b8106beab-11819430.pdf?src-supplier=Rs; ComponentLink2URL: https://datasheet.ciiva.com/7941/1738694-7941861.pdf?src-supplier=Element14; ComponentLink2Description: https://datasheet.ciiva.com/7941/1738694-7941861.pdf?src-supplier=Element14; ComponentLink3URL: https://datasheet.ciiva.com/7941/1738694-7941862.pdf?src-supplier=Element14; ComponentLink3Description: https://datasheet.ciiva.com/7941/1738694-7941862.pdf?src-supplier=Element14; ComponentLink4URL: https://datasheet.ciiva.com/7941/1738694-7941863.pdf?src-supplier=Element14; ComponentLink4Description: https://datasheet.ciiva.com/7941/1738694-7941863.pdf?src-supplier=Element14; ComponentLink5URL: https://datasheet.ciiva.com/15190/getdatasheetpartid-330685-15190028.pdf?src-supplier=Verical; ComponentLink5Description: https://datasheet.ciiva.com/15190/getdatasheetpartid-330685-15190028.pdf?src-supplier=Verical; Supplier 1: Mouser; Supplier Part Number 1: 603-RC0805JR-070RL
R3 R9 = RC0805FR-131KL: Res Thick Film 0805 1K Ohm 1% 1/8W ±100ppm/°C Molded SMD SMD Paper T/R; Manufacturer: Yageo; Supplier: Digikey; Supplier Part Number: 13-RC0805FR-131KLCT-ND; Manufacturer Part Number: RC0805FR-131KL; RoHS: Yes; Category: Chip SMD Resistors; Stock: 23036; Pricing: 1=0.1, 10=0.016, 50=0.0132, 100=0.0102, 500=0.00868, 1000=0.00714, 5000=0.0051 (USD); ComponentLink1URL: https://datasheet.ciiva.com/5558/rc0805-5558261.pdf?src-supplier=Mouser; ComponentLink1Description: https://datasheet.ciiva.com/5558/rc0805-5558261.pdf?src-supplier=Mouser; Supplier 1: Mouser; Supplier Part Number 1: 603-RC0805FR-131KL
R4 R8 R12 = RC0805FR-07560RL: Res General Purpose Thick Film 0805 560 Ohm 1% 1/8W ±100ppm/°C Molded Paper T/R; Manufacturer: Yageo; Supplier: Digikey; Supplier Part Number: 311-560CRCT-ND; Manufacturer Part Number: RC0805FR-07560RL; RoHS: Yes; Category: Chip SMD Resistors; Stock: 65174; Pricing: 1=0.1, 10=0.016, 50=0.0132, 100=0.0102, 500=0.00868, 1000=0.00781 (USD); Supplier 1: Digikey; Supplier Part Number 1: 311-560CRCT-ND
R5 R7 R11 R15 = RC0805FR-1322RL: Fixed Resistor, Metal Glaze/thick Film, 0.125W, 22ohm, 150V, 1% +/-Tol, 100ppm/Cel, Surface Mount, 0805; Manufacturer: Yageo; Additional Feature: LASER TRIMMABLE; Power: 125mW; Rated Temperature: 70°C; Temperature Coefficient: 100ppm/°C; Package Height: 0.5mm; Package Length: 2mm; Package Width: 1.25mm; Supplier: Digikey; Supplier Part Number: 13-RC0805FR-1322RLCT-ND; Manufacturer Part Number: RC0805FR-1322RL; RoHS: Yes; Category: Chip SMD Resistors; Stock: 41437; Pricing: 1=0.1, 10=0.016, 50=0.0132, 100=0.0102, 500=0.00868, 1000=0.00714, 5000=0.00459, 10000=0.00408 (USD); Mounting Technology: Surface Mount; Pins: 2; Package Shape: Rectangular; Case/Package: 0805; Terminal Finish: Nickel; Min Operating Temperature: -55°C; Max Operating Temperature: 155°C; Tolerance: 1%; JESD-609 Code: e3; Resistor Type: FIXED RESISTOR; Construction: Chip; Packaging: Tape and Reel; Value: 22R; Technology: METAL GLAZE/THICK FILM; Termination: Wraparound; Working Voltage: 150V; Reach SVHC Compliant: Yes; RoHS Compliant: Yes; ComponentLink1URL: https://datasheet.ciiva.com:443/pdfs/VipMasterIC/IC/YAGO/YAGO-S-A0008145938/YAGO-S-A0008145938-1.pdf?src-supplier=IHS+Markit; ComponentLink1Description: https://datasheet.ciiva.com:443/pdfs/VipMasterIC/IC/YAGO/YAGO-S-A0008145938/YAGO-S-A0008145938-1.pdf?src-supplier=IHS+Markit; ComponentLink2URL: https://datasheet.ciiva.com/12560/rc0805-257173-12560809.pdf?src-supplier=Mouser; ComponentLink2Description: https://datasheet.ciiva.com/12560/rc0805-257173-12560809.pdf?src-supplier=Mouser; Supplier 1: Digikey; Supplier Part Number 1: 13-RC0805FR-1322RLCT-ND
R6 = RC0805FR-07100RL: Fixed Resistor, Metal Glaze/thick Film, 0.125W, 100ohm, 150V, 1% +/-Tol, 100ppm/Cel, Surface Mount, 0805; Manufacturer: Yageo; Additional Feature: LASER TRIMMABLE; Power: 125mW; Rated Temperature: 70°C; Temperature Coefficient: 100ppm/°C; Package Height: 0.5mm; Package Length: 2mm; Package Width: 1.25mm; Supplier: Mouser; Supplier Part Number: 603-RC0805FR-07100RL; Manufacturer Part Number: RC0805FR-07100RL; RoHS: Yes; Category: Chip SMD Resistors; Stock: 898964; Pricing: 1=0.1, 10=0.016, 50=0.016, 100=0.014, 1000=0.009, 10000=0.004 (USD); Mounting Technology: Surface Mount; Pins: 2; Package Shape: Rectangular; Case/Package: 0805; Terminal Finish: Nickel; Min Operating Temperature: -55°C; Max Operating Temperature: 155°C; Tolerance: 1%; JESD-609 Code: e3; Resistor Type: FIXED RESISTOR; Construction: Chip; Packaging: Tape and Reel; Value: 100R; Technology: METAL GLAZE/THICK FILM; Termination: Wraparound; Working Voltage: 150V; Reach SVHC Compliant: Yes; RoHS Compliant: Yes; ComponentLink1URL: https://datasheet.ciiva.com:443/pdfs/VipMasterIC/IC/YAGO/YAGO-S-A0008145938/YAGO-S-A0008145938-1.pdf?src-supplier=IHS+Markit; ComponentLink1Description: https://datasheet.ciiva.com:443/pdfs/VipMasterIC/IC/YAGO/YAGO-S-A0008145938/YAGO-S-A0008145938-1.pdf?src-supplier=IHS+Markit; ComponentLink2URL: https://datasheet.ciiva.com/11808/0900766b8106beab-11808877.pdf?src-supplier=Rs; ComponentLink2Description: https://datasheet.ciiva.com/11808/0900766b8106beab-11808877.pdf?src-supplier=Rs; ComponentLink3URL: https://datasheet.ciiva.com/7941/1697719-7941680.pdf?src-supplier=Element14; ComponentLink3Description: https://datasheet.ciiva.com/7941/1697719-7941680.pdf?src-supplier=Element14; ComponentLink4URL: https://datasheet.ciiva.com/7941/1686128-7941679.pdf?src-supplier=Element14; ComponentLink4Description: https://datasheet.ciiva.com/7941/1686128-7941679.pdf?src-supplier=Element14; ComponentLink5URL: https://datasheet.ciiva.com/46447/444164-46447562.pdf?src-supplier=Element14; ComponentLink5Description: https://datasheet.ciiva.com/46447/444164-46447562.pdf?src-supplier=Element14; ComponentLink6URL: https://datasheet.ciiva.com/2456/pyu-r-int-thick-7-2456989.pdf?src-supplier=Digikey; ComponentLink6Description: https://datasheet.ciiva.com/2456/pyu-r-int-thick-7-2456989.pdf?src-supplier=Digikey; ComponentLink7URL: https://datasheet.ciiva.com/2456/pyu-r-int-thick-7-2456987.pdf?src-supplier=Digikey; ComponentLink7Description: https://datasheet.ciiva.com/2456/pyu-r-int-thick-7-2456987.pdf?src-supplier=Digikey; ComponentLink8URL: https://datasheet.ciiva.com/17082/rc0805-17082697.pdf?src-supplier=Future+Electronics; ComponentLink8Description: https://datasheet.ciiva.com/17082/rc0805-17082697.pdf?src-supplier=Future+Electronics; ComponentLink9URL: https://datasheet.ciiva.com/7660/38627-7660797.pdf?src-supplier=Element14; ComponentLink9Description: https://datasheet.ciiva.com/7660/38627-7660797.pdf?src-supplier=Element14; ComponentLink10URL: https://datasheet.ciiva.com/22747/444164-22747535.pdf?src-supplier=Element14; ComponentLink10Description: https://datasheet.ciiva.com/22747/444164-22747535.pdf?src-supplier=Element14; ComponentLink11URL: https://datasheet.ciiva.com/2456/pyu-r-int-thick-7-2456988.pdf?src-supplier=Digikey; ComponentLink11Description: https://datasheet.ciiva.com/2456/pyu-r-int-thick-7-2456988.pdf?src-supplier=Digikey; Supplier 1: Mouser; Supplier Part Number 1: 603-RC0805FR-07100RL
R10 R13 = RC0805FR-1010KL: Fixed Resistor, Metal Glaze/thick Film, 0.125W, 10000ohm, 150V, 1% +/-Tol, 100ppm/Cel, Surface Mount, 0805; Manufacturer: Yageo; Additional Feature: LASER TRIMMABLE; Power: 125mW; Rated Temperature: 70°C; Value: 10kR; Temperature Coefficient: 100ppm/°C; Package Height: 0.5mm; Package Length: 2mm; Package Width: 1.25mm; Supplier: Digikey; Supplier Part Number: 13-RC0805FR-1010KLCT-ND; Manufacturer Part Number: RC0805FR-1010KL; RoHS: Yes; Category: Chip SMD Resistors; Stock: 38925; Pricing: 1=0.1, 10=0.016, 50=0.0132, 100=0.0087, 500=0.00714, 1000=0.00612 (USD); Mounting Technology: Surface Mount; Pins: 2; Package Shape: Rectangular; Case/Package: 0805; Terminal Finish: Nickel; Min Operating Temperature: -55°C; Max Operating Temperature: 155°C; Tolerance: 1%; JESD-609 Code: e3; Termination: Wraparound; Resistor Type: FIXED RESISTOR; Construction: Chip; Packaging: Tape and Reel; Technology: METAL GLAZE/THICK FILM; Working Voltage: 150V; Reach SVHC Compliant: Yes; RoHS Compliant: Yes; ComponentLink1URL: https://datasheet.ciiva.com:443/pdfs/VipMasterIC/IC/YAGO/YAGO-S-A0008145938/YAGO-S-A0008145938-1.pdf?src-supplier=IHS+Markit; ComponentLink1Description: https://datasheet.ciiva.com:443/pdfs/VipMasterIC/IC/YAGO/YAGO-S-A0008145938/YAGO-S-A0008145938-1.pdf?src-supplier=IHS+Markit; ComponentLink2URL: https://datasheet.ciiva.com/7983/444164-7983754.pdf?src-supplier=Element14; ComponentLink2Description: https://datasheet.ciiva.com/7983/444164-7983754.pdf?src-supplier=Element14; ComponentLink3URL: https://datasheet.ciiva.com/15190/getdatasheetpartid-496654-15190027.pdf?src-supplier=Verical; ComponentLink3Description: https://datasheet.ciiva.com/15190/getdatasheetpartid-496654-15190027.pdf?src-supplier=Verical; Supplier 1: Digikey; Supplier Part Number 1: 13-RC0805FR-1010KLCT-ND
R14 = RC0805JR-13100ML: Fixed Resistor, Metal Glaze/thick Film, 0.125W, 100000000ohm, 150V, 5% +/-Tol, 300ppm/Cel, Surface Mount, 0805; Manufacturer: Yageo; Additional Feature: LASER TRIMMABLE; Power: 125mW; Rated Temperature: 70°C; Value: 100MR; Temperature Coefficient: 300ppm/°C; Package Height: 0.5mm; Package Length: 2mm; Package Width: 1.25mm; Supplier: Mouser; Supplier Part Number: 603-RC0805JR-13100ML; Manufacturer Part Number: RC0805JR-13100ML; RoHS: Yes; Category: Chip SMD Resistors; Stock: 37378; Pricing: 1=0.13, 10=0.047, 50=0.047, 100=0.04, 1000=0.025, 10000=0.013 (USD); Mounting Technology: Surface Mount; Pins: 2; Package Shape: Rectangular; Case/Package: 0805; Terminal Finish: Nickel; Min Operating Temperature: -55°C; Max Operating Temperature: 155°C; Tolerance: 5%; JESD-609 Code: e3; Resistor Type: FIXED RESISTOR; Construction: Chip; Packaging: Tape and Reel; Technology: METAL GLAZE/THICK FILM; Termination: Wraparound; Working Voltage: 150V; Reach SVHC Compliant: Yes; RoHS Compliant: Yes; ComponentLink1URL: https://datasheet.ciiva.com:443/pdfs/VipMasterIC/IC/YAGO/YAGO-S-A0008145938/YAGO-S-A0008145938-1.pdf?src-supplier=IHS+Markit; ComponentLink1Description: https://datasheet.ciiva.com:443/pdfs/VipMasterIC/IC/YAGO/YAGO-S-A0008145938/YAGO-S-A0008145938-1.pdf?src-supplier=IHS+Markit; ComponentLink2URL: https://datasheet.octopart.com/RC0805JR-13100ML-Yageo-datasheet-8324252.pdf?src-supplier=Future+Electronics; ComponentLink2Description: https://datasheet.octopart.com/RC0805JR-13100ML-Yageo-datasheet-8324252.pdf?src-supplier=Future+Electronics; Supplier 1: Mouser; Supplier Part Number 1: 603-RC0805JR-13100ML